# EAGLE schematic Skematik (EAGLE 9.6.2)
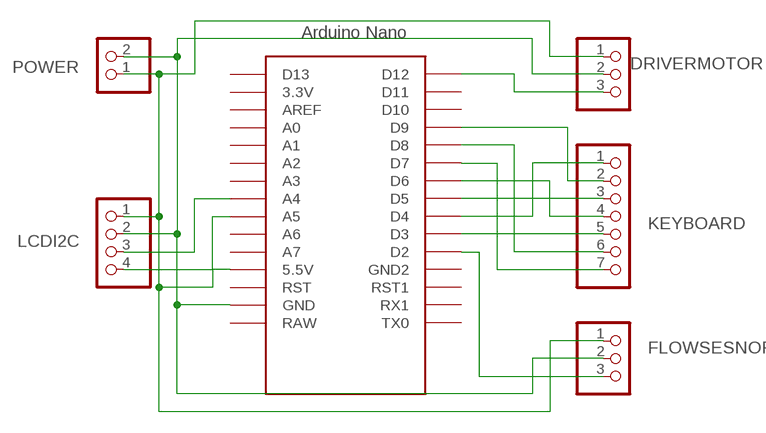
[diagram p0: schematic, sheet 1]

## Parts
DRIVERMOTOR  PINHD-1X3  [1X03]
FLOWSESNOR  PINHD-1X3  [1X03]
KEYBOARD  PINHD-1X7  [1X07]
LCDI2C  PINHD-1X4  [1X04]
POWER  PINHD-1X2  [1X02]
U$1  NANO  [NANO]

## Nets
N$1: LCDI2C.3 U$1.A4
N$2: DRIVERMOTOR.1 FLOWSESNOR.1 LCDI2C.1 LCDI2C.4 POWER.1 U$1.5V(5.5V) U$1.A5
N$4: DRIVERMOTOR.2 FLOWSESNOR.2 LCDI2C.2 POWER.2 U$1.GND
N$5: DRIVERMOTOR.3 U$1.D12
N$6: KEYBOARD.1 U$1.D4
N$7: KEYBOARD.2 U$1.D9
N$8: KEYBOARD.3 U$1.D5
N$9: KEYBOARD.4 U$1.D6
N$10: KEYBOARD.5 U$1.D3
N$11: KEYBOARD.6 U$1.D8
N$12: KEYBOARD.7 U$1.D7
N$13: FLOWSESNOR.3 U$1.D2
Unconnected: U$1.3.3V U$1.A0 U$1.A1 U$1.A2 U$1.A3 U$1.A6 U$1.A7 U$1.AREF U$1.D10 U$1.D11 U$1.D13 U$1.GND1(GND2) U$1.ICSP1 U$1.ICSP2 U$1.ICSP3 U$1.ICSP4 U$1.ICSP5 U$1.ICSP6 U$1.RAW U$1.RST U$1.RST1 U$1.RX1 U$1.TX0

## Library data of the parts
DRIVERMOTOR FLOWSESNOR = pinhead:PINHD-1X3: PIN HEADER
KEYBOARD = pinhead:PINHD-1X7: PIN HEADER
LCDI2C = pinhead:PINHD-1X4: PIN HEADER
POWER = pinhead:PINHD-1X2: PIN HEADER
U$1 = Arduino-clone:NANO: Arduino Nano